# Altium schematic sheet ESP32.SchDoc
size A4; SheetNumber: 2; SheetTotal: 6
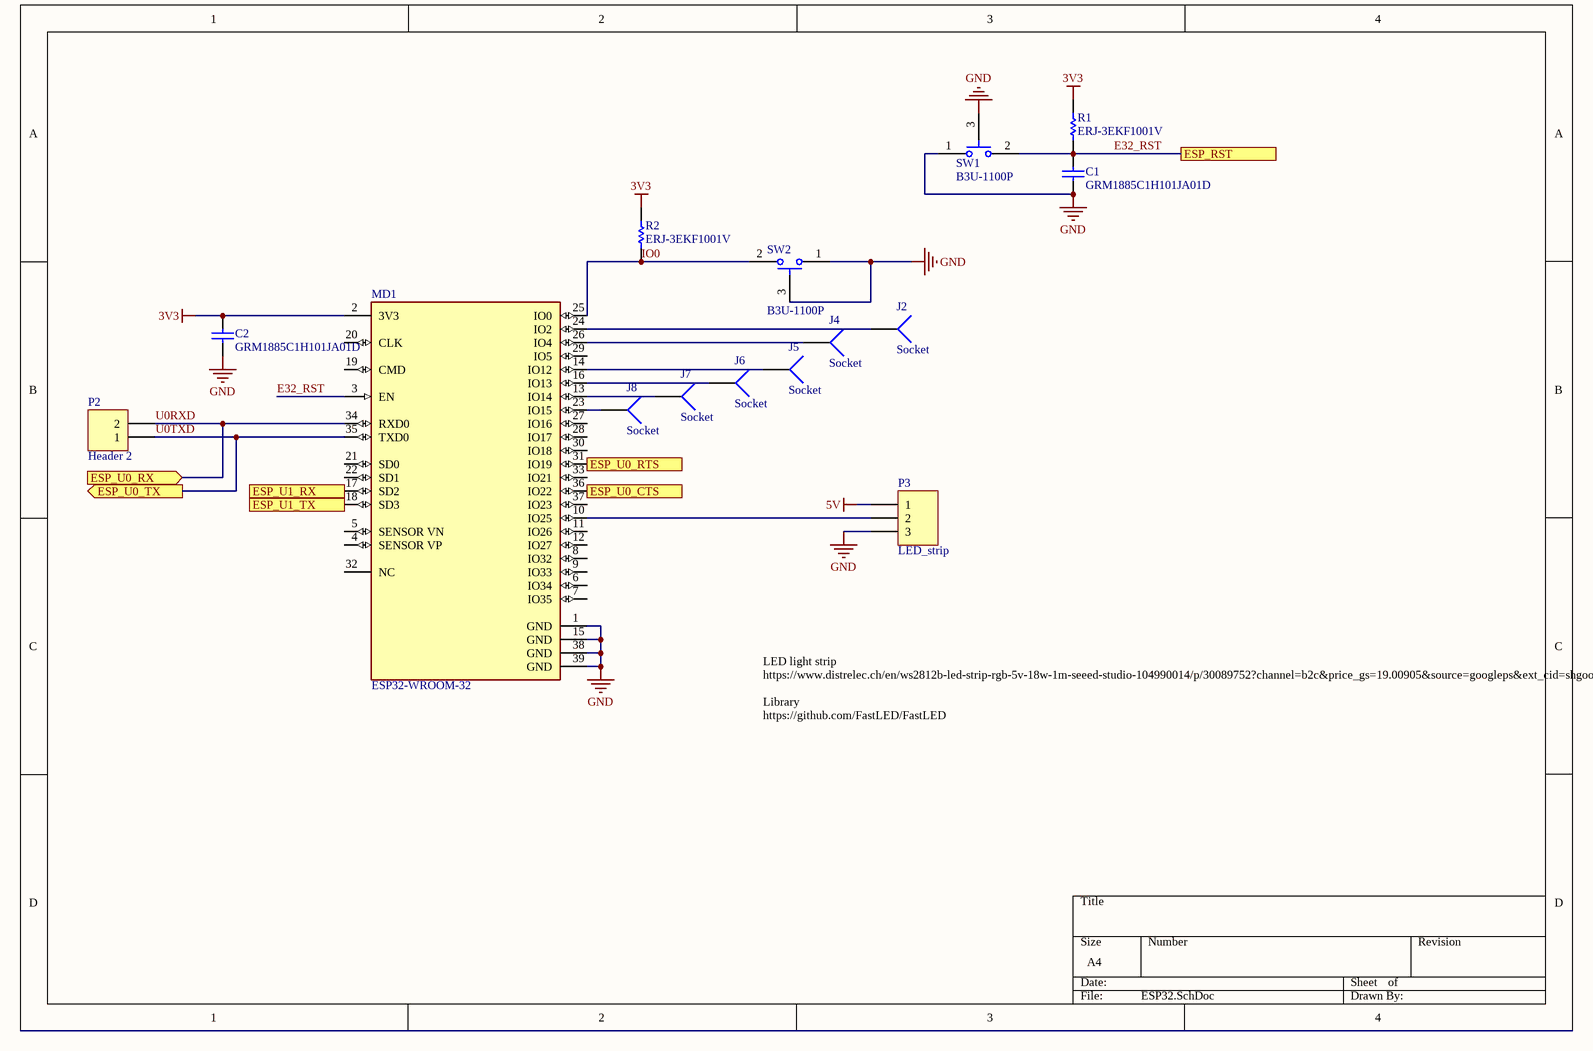
[diagram p0: ESP32.SchDoc]

## Parts
C1  GRM1885C1H101JA01D  [CAPC1608X90X35ML10T15]
C2  GRM1885C1H101JA01D  [CAPC1608X90X35ML10T15]
J2  Socket  [PIN1]
J4  Socket  [PIN1]
J5  Socket  [PIN1]
J6  Socket  [PIN1]
J7  Socket  [PIN1]
J8  Socket  [PIN1]
MD1  ESP32-WROOM-32  [FP-ESP32-WROOM-32-MFG]
P2  Header 2  [HDR1X2]
P3  LED_strip  [HDR1X3]
R1  ERJ-3EKF1001V  [RESC1608X55X30ML15T15]
R2  ERJ-3EKF1001V  [RESC1608X55X30ML15T15]
SW1  B3U-1100P  [FP-B3U-1100P-MFG]
SW2  B3U-1100P  [FP-B3U-1100P-MFG]

## Ports
ESP_RST, ESP_U0_CTS (in), ESP_U0_RTS (in), ESP_U0_RX (in), ESP_U0_TX (out), ESP_U1_RX (in), ESP_U1_TX (out)

## Nets
3V3: C2.2 MD1.2(3V3) R1.2 R2.2
5V: P3.1
GND: C1.1 C2.1 MD1.1(GND) MD1.15(GND) MD1.38(GND) MD1.39(GND) P3.3 SW1.1 SW1.3 SW2.1 SW2.3
E32_RST: C1.2 MD1.3(EN) R1.1 SW1.2 ; port ESP_RST
ESP_U0_CTS: MD1.36(IO22) ; port ESP_U0_CTS
ESP_U0_RTS: MD1.31(IO19) ; port ESP_U0_RTS
ESP_U1_RX: MD1.17(SD2) ; port ESP_U1_RX
ESP_U1_TX: MD1.18(SD3) ; port ESP_U1_TX
IO0: MD1.25(IO0) R2.1 SW2.2
U0RXD: MD1.34(RXD0) P2.2 ; port ESP_U0_RX
U0TXD: MD1.35(TXD0) P2.1 ; port ESP_U0_TX
NetJ2_1: J2.1 MD1.24(IO2)
NetJ4_1: J4.1 MD1.26(IO4)
NetJ5_1: J5.1 MD1.14(IO12)
NetJ6_1: J6.1 MD1.16(IO13)
NetJ7_1: J7.1 MD1.13(IO14)
NetJ8_1: J8.1 MD1.23(IO15)
NetMD1_10: MD1.10(IO25) P3.2

Not connected (* = marked no-connect by the designer): MD1 4(SENSOR_VP) 5(SENSOR_VN) 6(IO34) 7(IO35) 8(IO32) 9(IO33) 11(IO26) 12(IO27) 19(CMD) 20(CLK) 21(SD0) 22(SD1) 27(IO16) 28(IO17) 29(IO5) 30(IO18) 32(NC) 33(IO21) 37(IO23)

## Notes on the sheet
- LED light strip
  https://www.distrelec.ch/en/ws2812b-led-strip-rgb-5v-18w-1m-seeed-studio-104990014/p/30089752?channel=b2c&price_gs=19.00905&source=googleps&ext_cid=shgooaqchen-blcss&kw=%7Bkeyword%7D&ext_cid=shgooaqchen-P-CSS-Shopping-Lighting&pi=30089752&gclid=CjwKCAjww-CGBhALEiwAQzWxOvH7Gs9yD2iBi4Gc1DNC2TtA9CMgRWs6OTP8T3pO5lNEQTRO2M92tBoC6-AQAvD_BwE
  Library
  https://github.com/FastLED/FastLED

## Library data of the parts
C1 C2 = CMP-2006-02595-1: Manufacturer: Murata; Part Number: GRM1885C1H101JA01D
MD1 = CMP-194065-000008-1: RX TXRX MOD WIFI SURFACE MOUNT; Frequency: 2.5GHz; Sensitivity: -98dBm; Operating Supply Voltage: 3.6V; Data Rate: 150Mbps; Weight: 0.088185oz; Package Quantity: 550; Min Operating Temperature: -40°C; Mount: Surface Mount; Max Operating Temperature: 85°C; Packaging: Cut Tape; Case/Package: SMD/SMT
P2 = Header 2: Header, 2-Pin; LatestRevisionDate: 17-Jul-2002; LatestRevisionNote: Re-released for DXP Platform.; Publisher: Altium Limited
P3 = Header 3: Header, 3-Pin; LatestRevisionDate: 17-Jul-2002; LatestRevisionNote: Re-released for DXP Platform.; Publisher: Altium Limited
R1 R2 = CMP-2000-00180-1: Manufacturer: Panasonic; Part Number: ERJ-3EKF1001V
SW1 SW2 = CMP-2000-05903-2: SWITCH TACTILE SPST-NO 0.05A 12V; Switch Function: Off-Mom; Operating Force: 1.5N; Mechanical Life: 200000Cycles; Max Current Rating: 50mA; Illumination Type: Non-Illuminated; Actuator Type: Standard; Throw Configuration: SPST; Switch Travel: 0.15mm; Contact Resistance: 100mR; Actuator Length: 0.4mm; Ratings: Dust Proof; Termination: SMD/SMT; Packaging: Tape and Reel; Contact Plating: Silver; Max Operating Temperature: 70°C; Current Rating: 50mA; Electrical Life: 200000Cycles; Voltage Rating (DC): 12V; Length: 3.15mm; Weight: 0.022g; Min Operating Temperature: -25°C; Orientation: Straight; Contact Current Rating: 50mA; Package Quantity: 1; Max Voltage Rating (DC): 12V; Depth: 4mm; Lead Free: Lead Free; Mount: Surface Mount
J2 J4-J8 = Socket: LatestRevisionDate: 17-Jul-2002; LatestRevisionNote: Re-released for DXP Platform.; Publisher: Altium Limited